# Altium schematic sheet 公共电路 -（十二专用） .SchDoc: Dozen IO控制器
size A4; Revision: V1.5; Time: 2014年3月27日11:29:06
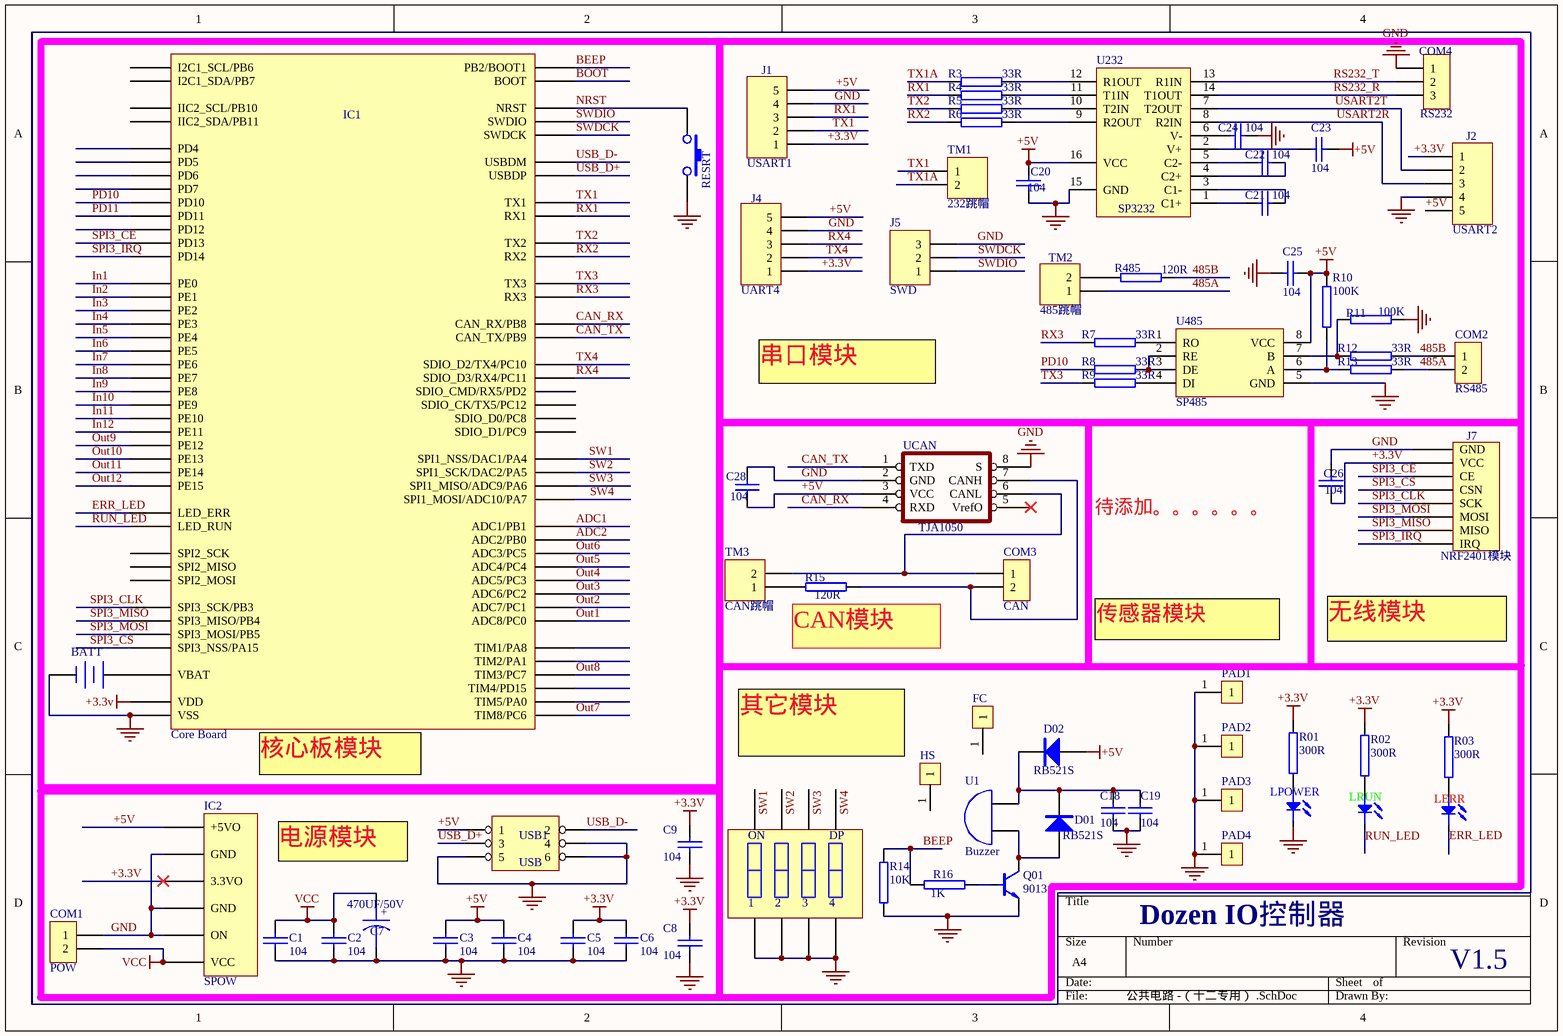
[diagram p0: 公共电路 -（十二专用） .SchDoc]

## Parts
BATT  电源底座  [MINI-BAT]  (value not drawn)
C1  104  [0603A]
C2  104  [0603A]
C3  104  [0603A]
C4  104  [0603A]
C5  104  [0603A]
C6  104  [0603A]
C7  470UF/50V  [电解电容10mm]
C8  104  [0603A]
C9  104  [0603A]
C18  104  [0603A]
C19  104  [0603A]
C20  104  [0603A]
C21  104  [0603A]
C22  104  [0603A]
C23  104  [0603A]
C24  104  [0603A]
C25  104  [0603A]
C26  104  [0603A]
C28  104  [0603A]
COM1  POW  [CON2-5.1卧]
COM2  RS485  [CON2-5.1卧]
COM3  CAN  [CON2-5.1卧]
COM4  RS232  [CON3-5.1卧]
D01  RB521S  [贴片二极管]
D02  RB521S  [贴片二极管]
FC  (no value)  [fc]
HS  (no value)  [HS]
IC1  Core Board  [核心板-物联网1]
IC2  SPOW  [电源板]
J1  USART1  [2.54排针1*5]
J2  USART2  [2.54排针1*5]
J4  UART4  [2.54排针1*5]
J5  SWD  [2.54排针1*3]
J7  NRF2401模块  [NRF24L01]
LERR  ERR  [LED2.5]  (value not drawn)
LPOWER  PLED  [LED2.5]  (value not drawn)
LRUN  RUN  [LED2.5]  (value not drawn)
PAD1  PAD  [PAD]  (value not drawn)
PAD2  PAD  [PAD]  (value not drawn)
PAD3  PAD  [PAD]  (value not drawn)
PAD4  PAD  [PAD]  (value not drawn)
Q01  9013  [SOT23]
R01  300R  [0603A]
R02  300R  [0603A]
R03  300R  [0603A]
R3  33R  [0603A]
R4  33R  [0603A]
R5  33R  [0603A]
R6  33R  [0603A]
R7  33R  [0603A]
R8  33R  [0603A]
R9  33R  [0603A]
R10  100K  [0603A]
R11  100K  [0603A]
R12  33R  [0603A]
R13  33R  [0603A]
R14  10K  [0603A]
R15  120R  [0603A]
R16  1K  [0603A]
R485  120R  [0603A]
S1  拨码开关*4  [SWITCH*4]  (value not drawn)
S2  RESRT  [SW-PB2]
TM1  232跳帽  [2.54排针1*2]
TM2  485跳帽  [2.54排针1*2]
TM3  CAN跳帽  [2.54排针1*2]
U1  Buzzer  [蜂鸣器]
U232  SP3232  [TSSOP16]
U485  SP485  [SO8_L]
UCAN  TJA1050  [SO8_L]
USB1  USB  [USB-B3]

## Nets
+3.3V: C5.1 C6.1 C8.1 C9.1 C26.2 IC1.2(VDD) IC2.3(3.3VO) J1.1 J2.1 J4.1 J7.2(VCC) R01.1 R02.1 R03.1
+5V: C3.1 C4.1 C20.1 C23.2 C25.2 C28.2 D02.A IC2.1(+5VO) J1.5 J2.5 J4.5 R10.2 U232.16(VCC) U485.8(VCC) UCAN.3(VCC) USB1.1
GND: BATT.2(-) C1.2 C2.2 C3.2 C4.2 C5.2 C6.2 C7.2 C8.2 C9.2 C18.2 C19.2 C20.2 C24.2 C25.1 C26.1 C28.1 COM1.1 COM4.1 IC1.1(VSS) IC2.2(GND) IC2.4(GND) IC2.5(ON) J1.4 J2.4 J4.4 J5.3 J7.1(GND) LPOWER.K PAD1.1 PAD2.1 PAD3.1 PAD4.1 Q01.2(e) R11.2 R14.1 S1.5 S1.6 S1.7 S1.8 S2.2 U232.15(GND) U485.5(GND) UCAN.2(GND) UCAN.8(S) USB1.4 USB1.5 USB1.6
VCC: C1.1 C2.1 C7.1 COM1.2 IC2.6(VCC)
485A: COM2.2 R13.2 TM2.1
485B: COM2.1 R12.2 R485.2
ADC1: IC1.33(ADC1/PB1)
ADC2: IC1.34(ADC2/PB0)
BEEP: IC1.31(PB2/BOOT1) R14.2 R16.1
BOOT: IC1.3(BOOT)
CAN_RX: IC1.68(CAN_RX/PB8) UCAN.4(RXD)
CAN_TX: IC1.67(CAN_TX/PB9) UCAN.1(TXD)
ERR_LED: IC1.11(LED_ERR) LERR.K
In1: IC1.58(PE0)
In2: IC1.57(PE1)
In3: IC1.56(PE2)
In4: IC1.55(PE3)
In5: IC1.54(PE4)
In6: IC1.53(PE5)
In7: IC1.52(PE6)
In8: IC1.51(PE7)
In9: IC1.30(PE8)
In10: IC1.29(PE9)
In11: IC1.28(PE10)
In12: IC1.27(PE11)
NRST: IC1.4(NRST) S2.1
Out1: IC1.49(ADC8/PC0)
Out2: IC1.50(ADC7/PC1)
Out3: IC1.47(ADC6/PC2)
Out4: IC1.48(ADC5/PC3)
Out5: IC1.36(ADC4/PC4)
Out6: IC1.35(ADC3/PC5)
Out7: IC1.41(TIM8/PC6)
Out8: IC1.44(TIM3/PC7)
Out9: IC1.26(PE12)
Out10: IC1.25(PE13)
Out11: IC1.24(PE14)
Out12: IC1.23(PE15)
PD10: IC1.13(PD10) R8.1
PD11: IC1.62(PD11)
RS232_R: COM4.3 U232.14(T1OUT)
RS232_T: COM4.2 U232.13(R1IN)
RUN_LED: IC1.12(LED_RUN) LRUN.K
RX1: IC1.10(RX1) J1.3 R4.1
RX2: IC1.18(RX2) R6.1
RX3: IC1.20(RX3) R7.1
RX4: IC1.80(SDIO_D3/RX4/PC11) J4.3
SPI3_CE: IC1.60(PD13) J7.3(CE)
SPI3_CLK: IC1.73(SPI3_SCK/PB3) J7.5(SCK)
SPI3_CS: IC1.74(SPI3_NSS/PA15) J7.4(CSN)
SPI3_IRQ: IC1.59(PD14) J7.8(IRQ)
SPI3_MISO: IC1.72(SPI3_MISO/PB4) J7.7(MISO)
SPI3_MOSI: IC1.71(SPI3_MOSI/PB5) J7.6(MOSI)
SW1: IC1.39(SPI1_NSS/DAC1/PA4) S1.1
SW2: IC1.40(SPI1_SCK/DAC2/PA5) S1.2
SW3: IC1.37(SPI1_MISO/ADC9/PA6) S1.3
SW4: IC1.38(SPI1_MOSI/ADC10/PA7) S1.4
SWDCK: IC1.6(SWDCK) J5.2
SWDIO: IC1.5(SWDIO) J5.1
TX1: IC1.9(TX1) J1.2 TM1.1
TX1A: R3.1 TM1.2
TX2: IC1.17(TX2) R5.1
TX3: IC1.19(TX3) R9.1
TX4: IC1.79(SDIO_D2/TX4/PC10) J4.2
USART2R: J2.3 U232.8(R2IN)
USART2T: J2.2 U232.7(T2OUT)
USB_D+: IC1.8(USBDP) USB1.3
USB_D-: IC1.7(USBDM) USB1.2
NetBATT_1: BATT.1(+) IC1.32(VBAT)
NetC18_1: C18.1 C19.1 D01.K D02.K U1.1(A)
NetC21_1: C21.1 U232.1(C1+)
NetC21_2: C21.2 U232.3(C1-)
NetC22_1: C22.1 U232.5(C2-)
NetC22_2: C22.2 U232.4(C2+)
NetC23_1: C23.1 U232.2(V+)
NetC24_1: C24.1 U232.6(V-)
NetCOM3_1: COM3.1 TM3.2 UCAN.6(CANL)
NetCOM3_2: COM3.2 R15.2 UCAN.7(CANH)
NetD01_A: D01.A Q01.3(c) U1.2(B)
NetLERR_A: LERR.A R03.2
NetLPOWER_A: LPOWER.A R01.2
NetLRUN_A: LRUN.A R02.2
NetQ01_1: Q01.1(b) R16.2
NetR3_2: R3.2 U232.12(R1OUT)
NetR4_2: R4.2 U232.11(T1IN)
NetR5_2: R5.2 U232.10(T2IN)
NetR6_2: R6.2 U232.9(R2OUT)
NetR7_2: R7.2 U485.1(RO)
NetR8_2: R8.2 U485.2(RE) U485.3(DE)
NetR9_2: R9.2 U485.4(DI)
NetR10_1: R10.1 R13.1 U485.6(A)
NetR11_1: R11.1 R12.1 U485.7(B)
NetR15_1: R15.1 TM3.1
NetR485_1: R485.1 TM2.2

Not connected (* = marked no-connect by the designer): FC 1; HS 1; IC1 14(SPI2_SCK) 15(SPI2_MISO) 16(SPI2_MOSI) 21(IIC2_SDA/PB11) 22(IIC2_SCL/PB10) 42(TIM4/PD15) 43(TIM1/PA8) 45(TIM5/PA0) 46(TIM2/PA1) 61(PD12) 63(PD4) 64(PD5) 65(PD6) 66(PD7) 69(I2C1_SDA/PB7) 70(I2C1_SCL/PB6) 75(SDIO_D1/PC9) 76(SDIO_D0/PC8) 77(SDIO_CMD/RX5/PD2) 78(SDIO_CK/TX5/PC12); UCAN 5(VrefO)*

## Notes on the sheet
- 串口模块
- (near C26) 待添加。。。。。。
- (near R15) CAN模块
- (near PAD1) 传感器模块
- (near J7) 无线模块
- (near IC1) 核心板模块
- (near HS) 其它模块
- 电源模块
- (in symbol CAPACITOR POL) +
- (in symbol 拨码开关*4) ON; DP

## Library data of the parts
BATT = Battery: XH414H; Published: 24-Mar-1999; LatestRevisionDate: 17-Jul-2002; LatestRevisionNote: Re-released for DXP Platform.; PackageReference: BAT-2; Publisher: Altium Limited; PackageDescription: Battery; 2 Leads
C1-C6 C8 C9 C18-C26 C28 = CAP: Capacitor
C7 = CAPACITOR POL: Capacitor
COM1-COM3 = CON2
COM4 = CON3
FC HS = PAD
IC1 = 物联网核心板
J1 J2 J4 = Header 5: Header, 4-Pin; LatestRevisionDate: 17-Jul-2002; LatestRevisionNote: Re-released for DXP Platform.; Publisher: Altium Limited
J5 = Header 3: Header, 4-Pin; LatestRevisionDate: 17-Jul-2002; LatestRevisionNote: Re-released for DXP Platform.; Publisher: Altium Limited
LERR LPOWER LRUN = LED
Q01 = NPN
R01 R02 R03 R3-R16 R485 = RES2
S2 = SW-PB
TM1-TM3 = Header 2: Header, 2-Pin; LatestRevisionDate: 17-Jul-2002; LatestRevisionNote: Re-released for DXP Platform.; Publisher: Altium Limited
U232 = SP3232EEA
USB1 = HEADER 3X2